# Altium schematic sheet 创世一号_键轴.SchDoc
size 699 x 350 mm
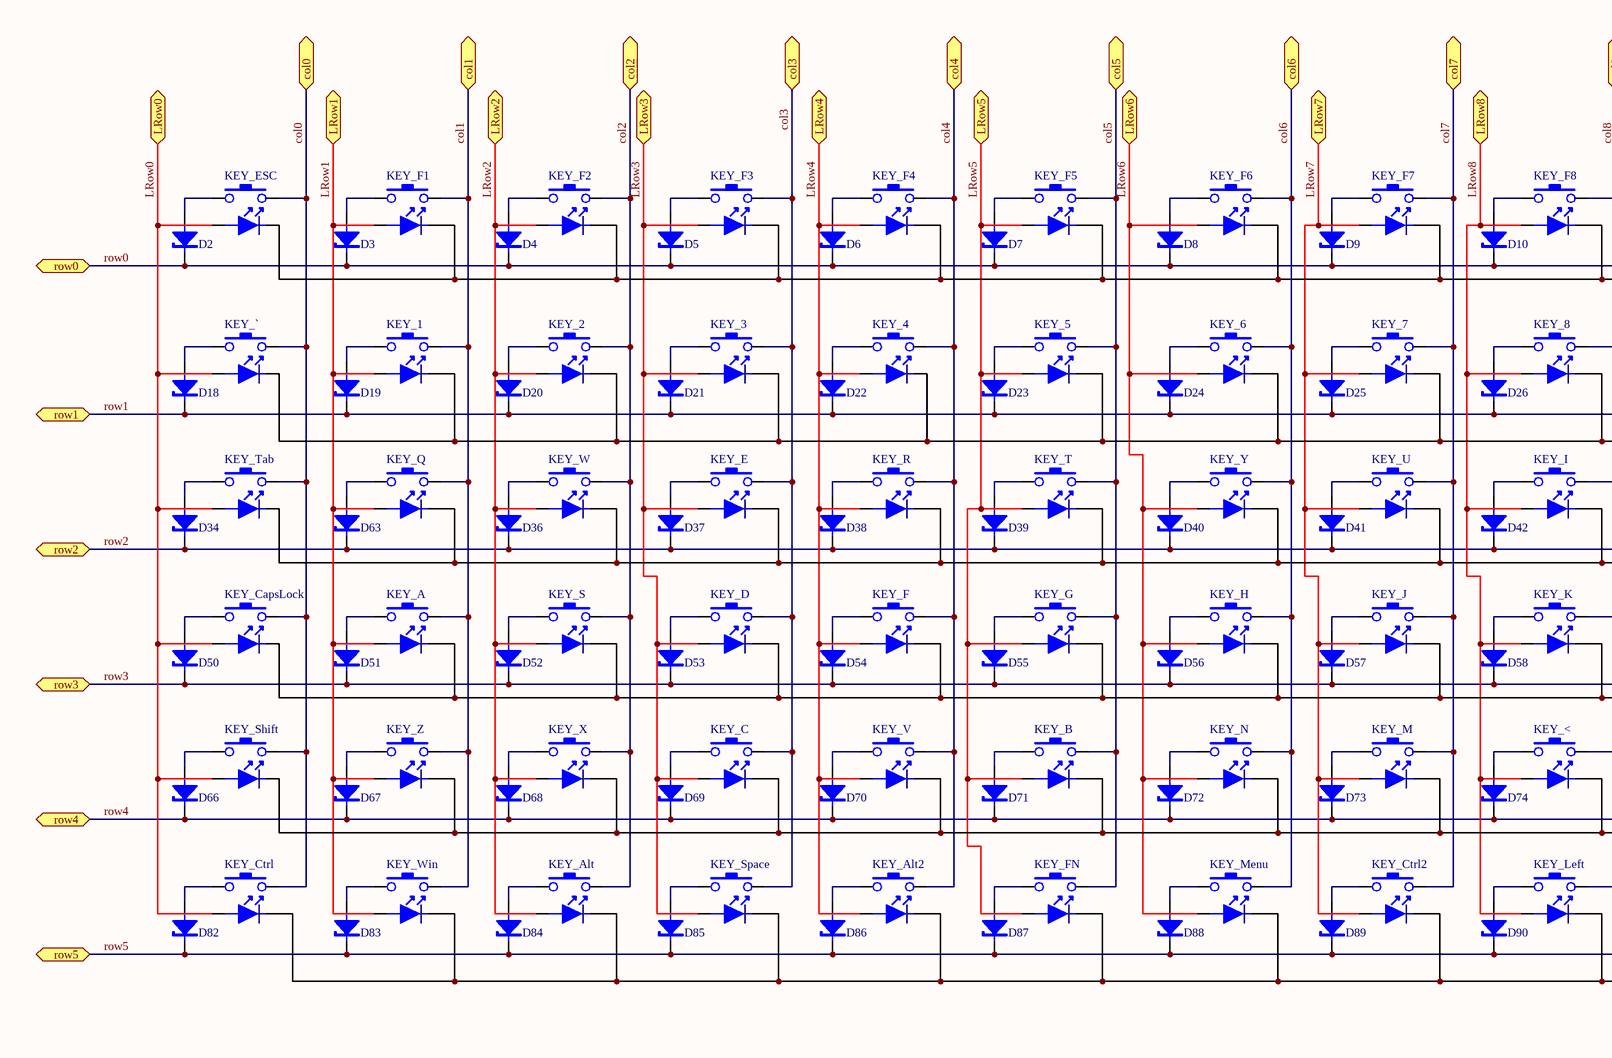
[diagram p0: 创世一号_键轴.SchDoc, left]
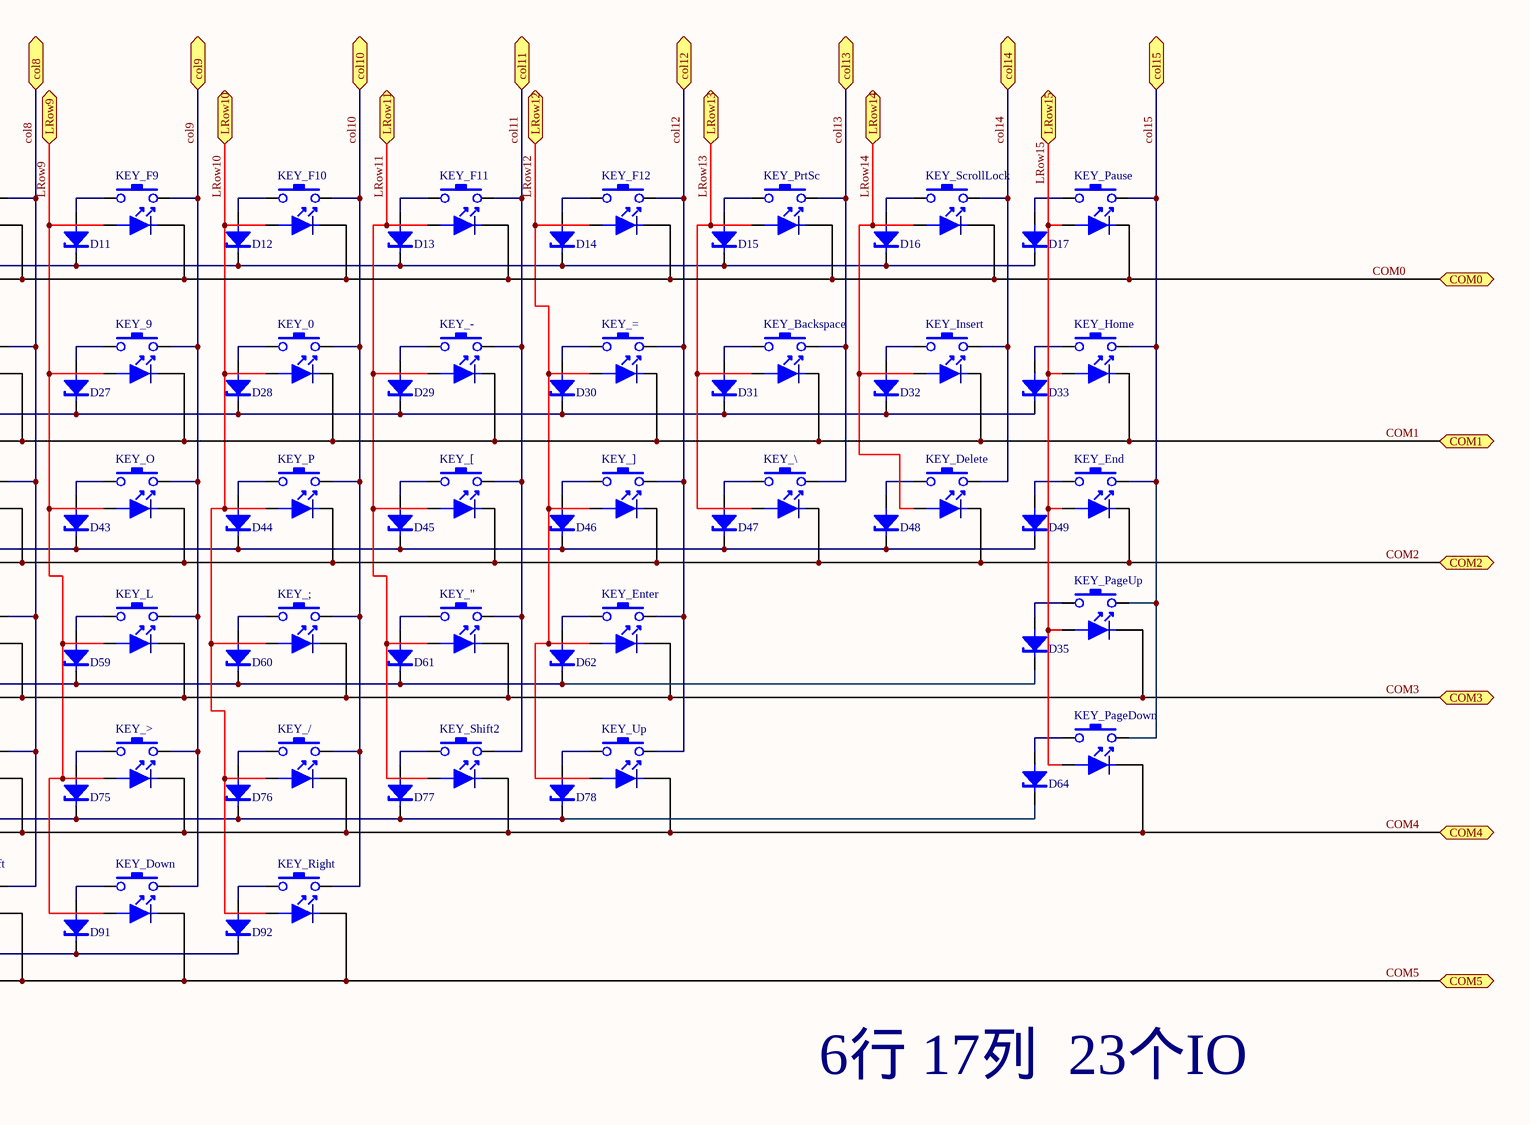
[diagram p1: 创世一号_键轴.SchDoc, right]

## Parts
D2  Diode  [SDO-123]  (value not drawn)
D3  Diode  [SDO-123]  (value not drawn)
D4  Diode  [SDO-123]  (value not drawn)
D5  Diode  [SDO-123]  (value not drawn)
D6  Diode  [SDO-123]  (value not drawn)
D7  Diode  [SDO-123]  (value not drawn)
D8  Diode  [SDO-123]  (value not drawn)
D9  Diode  [SDO-123]  (value not drawn)
D10  Diode  [SDO-123]  (value not drawn)
D11  Diode  [SDO-123]  (value not drawn)
D12  Diode  [SDO-123]  (value not drawn)
D13  Diode  [SDO-123]  (value not drawn)
D14  Diode  [SDO-123]  (value not drawn)
D15  Diode  [SDO-123]  (value not drawn)
D16  Diode  [SDO-123]  (value not drawn)
D17  Diode  [SDO-123]  (value not drawn)
D18  Diode  [SDO-123]  (value not drawn)
D19  Diode  [SDO-123]  (value not drawn)
D20  Diode  [SDO-123]  (value not drawn)
D21  Diode  [SDO-123]  (value not drawn)
D22  Diode  [SDO-123]  (value not drawn)
D23  Diode  [SDO-123]  (value not drawn)
D24  Diode  [SDO-123]  (value not drawn)
D25  Diode  [SDO-123]  (value not drawn)
D26  Diode  [SDO-123]  (value not drawn)
D27  Diode  [SDO-123]  (value not drawn)
D28  Diode  [SDO-123]  (value not drawn)
D29  Diode  [SDO-123]  (value not drawn)
D30  Diode  [SDO-123]  (value not drawn)
D31  Diode  [SDO-123]  (value not drawn)
D32  Diode  [SDO-123]  (value not drawn)
D33  Diode  [SDO-123]  (value not drawn)
D34  Diode  [SDO-123]  (value not drawn)
D35  Diode  [SDO-123]  (value not drawn)
D36  Diode  [SDO-123]  (value not drawn)
D37  Diode  [SDO-123]  (value not drawn)
D38  Diode  [SDO-123]  (value not drawn)
D39  Diode  [SDO-123]  (value not drawn)
D40  Diode  [SDO-123]  (value not drawn)
D41  Diode  [SDO-123]  (value not drawn)
D42  Diode  [SDO-123]  (value not drawn)
D43  Diode  [SDO-123]  (value not drawn)
D44  Diode  [SDO-123]  (value not drawn)
D45  Diode  [SDO-123]  (value not drawn)
D46  Diode  [SDO-123]  (value not drawn)
D47  Diode  [SDO-123]  (value not drawn)
D48  Diode  [SDO-123]  (value not drawn)
D49  Diode  [SDO-123]  (value not drawn)
D50  Diode  [SDO-123]  (value not drawn)
D51  Diode  [SDO-123]  (value not drawn)
D52  Diode  [SDO-123]  (value not drawn)
D53  Diode  [SDO-123]  (value not drawn)
D54  Diode  [SDO-123]  (value not drawn)
D55  Diode  [SDO-123]  (value not drawn)
D56  Diode  [SDO-123]  (value not drawn)
D57  Diode  [SDO-123]  (value not drawn)
D58  Diode  [SDO-123]  (value not drawn)
D59  Diode  [SDO-123]  (value not drawn)
D60  Diode  [SDO-123]  (value not drawn)
D61  Diode  [SDO-123]  (value not drawn)
D62  Diode  [SDO-123]  (value not drawn)
D63  Diode  [SDO-123]  (value not drawn)
D64  Diode  [SDO-123]  (value not drawn)
D66  Diode  [SDO-123]  (value not drawn)
D67  Diode  [SDO-123]  (value not drawn)
D68  Diode  [SDO-123]  (value not drawn)
D69  Diode  [SDO-123]  (value not drawn)
D70  Diode  [SDO-123]  (value not drawn)
D71  Diode  [SDO-123]  (value not drawn)
D72  Diode  [SDO-123]  (value not drawn)
D73  Diode  [SDO-123]  (value not drawn)
D74  Diode  [SDO-123]  (value not drawn)
D75  Diode  [SDO-123]  (value not drawn)
D76  Diode  [SDO-123]  (value not drawn)
D77  Diode  [SDO-123]  (value not drawn)
D78  Diode  [SDO-123]  (value not drawn)
D82  Diode  [SDO-123]  (value not drawn)
D83  Diode  [SDO-123]  (value not drawn)
D84  Diode  [SDO-123]  (value not drawn)
D85  Diode  [SDO-123]  (value not drawn)
D86  Diode  [SDO-123]  (value not drawn)
D87  Diode  [SDO-123]  (value not drawn)
D88  Diode  [SDO-123]  (value not drawn)
D89  Diode  [SDO-123]  (value not drawn)
D90  Diode  [SDO-123]  (value not drawn)
D91  Diode  [SDO-123]  (value not drawn)
D92  Diode  [SDO-123]  (value not drawn)
KEY_0  MX_SW  [MX_SW-5]  (value not drawn)
KEY_1  MX_SW  [MX_SW-5]  (value not drawn)
KEY_2  MX_SW  [MX_SW-5]  (value not drawn)
KEY_3  MX_SW  [MX_SW-5]  (value not drawn)
KEY_4  MX_SW  [MX_SW-5]  (value not drawn)
KEY_5  MX_SW  [MX_SW-5]  (value not drawn)
KEY_6  MX_SW  [MX_SW-5]  (value not drawn)
KEY_7  MX_SW  [MX_SW-5]  (value not drawn)
KEY_8  MX_SW  [MX_SW-5]  (value not drawn)
KEY_9  MX_SW  [MX_SW-5]  (value not drawn)
KEY_"  MX_SW  [MX_SW-5]  (value not drawn)
KEY_-  MX_SW  [MX_SW-5]  (value not drawn)
KEY_/  MX_SW  [MX_SW-5]  (value not drawn)
KEY_;  MX_SW  [MX_SW-5]  (value not drawn)
KEY_<  MX_SW  [MX_SW-5]  (value not drawn)
KEY_=  MX_SW  [MX_SW-5]  (value not drawn)
KEY_>  MX_SW  [MX_SW-5]  (value not drawn)
KEY_[  MX_SW  [MX_SW-5]  (value not drawn)
KEY_\  MX_SW  [MX_SW-5]  (value not drawn)
KEY_]  MX_SW  [MX_SW-5]  (value not drawn)
KEY_`  MX_SW  [MX_SW-5]  (value not drawn)
KEY_A  MX_SW  [MX_SW-5]  (value not drawn)
KEY_Alt  MX_SW  [MX_SW-5]  (value not drawn)
KEY_Alt2  MX_SW  [MX_SW-5]  (value not drawn)
KEY_B  MX_SW  [MX_SW-5]  (value not drawn)
KEY_Backspace  MX_SW  [MX_SW-5]  (value not drawn)
KEY_C  MX_SW  [MX_SW-5]  (value not drawn)
KEY_CapsLock  MX_SW  [MX_SW-5]  (value not drawn)
KEY_Ctrl  MX_SW  [MX_SW-5]  (value not drawn)
KEY_Ctrl2  MX_SW  [MX_SW-5]  (value not drawn)
KEY_D  MX_SW  [MX_SW-5]  (value not drawn)
KEY_Delete  MX_SW  [MX_SW-5]  (value not drawn)
KEY_Down  MX_SW  [MX_SW-5]  (value not drawn)
KEY_E  MX_SW  [MX_SW-5]  (value not drawn)
KEY_End  MX_SW  [MX_SW-5]  (value not drawn)
KEY_Enter  MX_SW  [MX_SW-5]  (value not drawn)
KEY_ESC  MX_SW  [MX_SW-5]  (value not drawn)
KEY_F  MX_SW  [MX_SW-5]  (value not drawn)
KEY_F1  MX_SW  [MX_SW-5]  (value not drawn)
KEY_F2  MX_SW  [MX_SW-5]  (value not drawn)
KEY_F3  MX_SW  [MX_SW-5]  (value not drawn)
KEY_F4  MX_SW  [MX_SW-5]  (value not drawn)
KEY_F5  MX_SW  [MX_SW-5]  (value not drawn)
KEY_F6  MX_SW  [MX_SW-5]  (value not drawn)
KEY_F7  MX_SW  [MX_SW-5]  (value not drawn)
KEY_F8  MX_SW  [MX_SW-5]  (value not drawn)
KEY_F9  MX_SW  [MX_SW-5]  (value not drawn)
KEY_F10  MX_SW  [MX_SW-5]  (value not drawn)
KEY_F11  MX_SW  [MX_SW-5]  (value not drawn)
KEY_F12  MX_SW  [MX_SW-5]  (value not drawn)
KEY_FN  MX_SW  [MX_SW-5]  (value not drawn)
KEY_G  MX_SW  [MX_SW-5]  (value not drawn)
KEY_H  MX_SW  [MX_SW-5]  (value not drawn)
KEY_Home  MX_SW  [MX_SW-5]  (value not drawn)
KEY_I  MX_SW  [MX_SW-5]  (value not drawn)
KEY_Insert  MX_SW  [MX_SW-5]  (value not drawn)
KEY_J  MX_SW  [MX_SW-5]  (value not drawn)
KEY_K  MX_SW  [MX_SW-5]  (value not drawn)
KEY_L  MX_SW  [MX_SW-5]  (value not drawn)
KEY_Left  MX_SW  [MX_SW-5]  (value not drawn)
KEY_M  MX_SW  [MX_SW-5]  (value not drawn)
KEY_Menu  MX_SW  [MX_SW-5]  (value not drawn)
KEY_N  MX_SW  [MX_SW-5]  (value not drawn)
KEY_O  MX_SW  [MX_SW-5]  (value not drawn)
KEY_P  MX_SW  [MX_SW-5]  (value not drawn)
KEY_PageDown  MX_SW  [MX_SW-5]  (value not drawn)
KEY_PageUp  MX_SW  [MX_SW-5]  (value not drawn)
KEY_Pause  MX_SW  [MX_SW-5]  (value not drawn)
KEY_PrtSc  MX_SW  [MX_SW-5]  (value not drawn)
KEY_Q  MX_SW  [MX_SW-5]  (value not drawn)
KEY_R  MX_SW  [MX_SW-5]  (value not drawn)
KEY_Right  MX_SW  [MX_SW-5]  (value not drawn)
KEY_S  MX_SW  [MX_SW-5]  (value not drawn)
KEY_ScrollLock  MX_SW  [MX_SW-5]  (value not drawn)
KEY_Shift  MX_SW  [MX_SW-5]  (value not drawn)
KEY_Shift2  MX_SW  [MX_SW-5]  (value not drawn)
KEY_Space  MX_SW  [MX_SW-5]  (value not drawn)
KEY_T  MX_SW  [MX_SW-5]  (value not drawn)
KEY_Tab  MX_SW  [MX_SW-5]  (value not drawn)
KEY_U  MX_SW  [MX_SW-5]  (value not drawn)
KEY_Up  MX_SW  [MX_SW-5]  (value not drawn)
KEY_V  MX_SW  [MX_SW-5]  (value not drawn)
KEY_W  MX_SW  [MX_SW-5]  (value not drawn)
KEY_Win  MX_SW  [MX_SW-5]  (value not drawn)
KEY_X  MX_SW  [MX_SW-5]  (value not drawn)
KEY_Y  MX_SW  [MX_SW-5]  (value not drawn)
KEY_Z  MX_SW  [MX_SW-5]  (value not drawn)

## Ports
col0 (bidir), col1 (bidir), col2 (bidir), col3 (bidir), col4 (bidir), col5 (bidir), col6 (bidir), col7 (bidir), col8 (bidir), col9 (bidir), col10 (bidir), col11 (bidir), col12 (bidir), col13 (bidir), col14 (bidir), col15 (bidir), COM0 (bidir), COM1 (bidir), COM2 (bidir), COM3 (bidir), COM4 (bidir), COM5 (bidir), LRow0 (bidir), LRow1 (bidir), LRow2 (bidir), LRow3 (bidir), LRow4 (bidir), LRow5 (bidir), LRow6 (bidir), LRow7 (bidir), LRow8 (bidir), LRow9 (bidir), LRow10 (bidir), LRow11 (bidir), LRow12 (bidir), LRow13 (bidir), LRow14 (bidir), LRow15 (bidir), row0 (bidir), row1 (bidir), row2 (bidir), row3 (bidir), row4 (bidir), row5 (bidir)

## Nets
col0: KEY_`.2 KEY_CapsLock.2 KEY_Ctrl.2 KEY_ESC.2 KEY_Shift.2 KEY_Tab.2 ; port col0
col1: KEY_1.2 KEY_A.2 KEY_F1.2 KEY_Q.2 KEY_Win.2 KEY_Z.2 ; port col1
col2: KEY_2.2 KEY_Alt.2 KEY_F2.2 KEY_S.2 KEY_W.2 KEY_X.2 ; port col2
col3: KEY_3.2 KEY_C.2 KEY_D.2 KEY_E.2 KEY_F3.2 KEY_Space.2 ; port col3
col4: KEY_4.2 KEY_Alt2.2 KEY_F.2 KEY_F4.2 KEY_R.2 KEY_V.2 ; port col4
col5: KEY_5.2 KEY_B.2 KEY_F5.2 KEY_FN.2 KEY_G.2 KEY_T.2 ; port col5
col6: KEY_6.2 KEY_F6.2 KEY_H.2 KEY_Menu.2 KEY_N.2 KEY_Y.2 ; port col6
col7: KEY_7.2 KEY_Ctrl2.2 KEY_F7.2 KEY_J.2 KEY_M.2 KEY_U.2 ; port col7
col8: KEY_8.2 KEY_<.2 KEY_F8.2 KEY_I.2 KEY_K.2 KEY_Left.2 ; port col8
col9: KEY_9.2 KEY_>.2 KEY_Down.2 KEY_F9.2 KEY_L.2 KEY_O.2 ; port col9
col10: KEY_0.2 KEY_/.2 KEY_;.2 KEY_F10.2 KEY_P.2 KEY_Right.2 ; port col10
col11: KEY_".2 KEY_-.2 KEY_[.2 KEY_F11.2 KEY_Shift2.2 ; port col11
col12: KEY_=.2 KEY_].2 KEY_Enter.2 KEY_F12.2 KEY_Up.2 ; port col12
col13: KEY_\.2 KEY_Backspace.2 KEY_PrtSc.2 ; port col13
col14: KEY_Delete.2 KEY_Insert.2 KEY_ScrollLock.2 ; port col14
col15: KEY_End.2 KEY_Home.2 KEY_PageDown.2 KEY_PageUp.2 KEY_Pause.2 ; port col15
COM0: KEY_ESC.4 KEY_F1.4 KEY_F2.4 KEY_F3.4 KEY_F4.4 KEY_F5.4 KEY_F6.4 KEY_F7.4 KEY_F8.4 KEY_F9.4 KEY_F10.4 KEY_F11.4 KEY_F12.4 KEY_Pause.4 KEY_PrtSc.4 KEY_ScrollLock.4 ; port COM0
COM1: KEY_0.4 KEY_1.4 KEY_2.4 KEY_3.4 KEY_4.4 KEY_5.4 KEY_6.4 KEY_7.4 KEY_8.4 KEY_9.4 KEY_-.4 KEY_=.4 KEY_`.4 KEY_Backspace.4 KEY_Home.4 KEY_Insert.4 ; port COM1
COM2: KEY_[.4 KEY_\.4 KEY_].4 KEY_Delete.4 KEY_E.4 KEY_End.4 KEY_I.4 KEY_O.4 KEY_P.4 KEY_Q.4 KEY_R.4 KEY_T.4 KEY_Tab.4 KEY_U.4 KEY_W.4 KEY_Y.4 ; port COM2
COM3: KEY_".4 KEY_;.4 KEY_A.4 KEY_CapsLock.4 KEY_D.4 KEY_Enter.4 KEY_F.4 KEY_G.4 KEY_H.4 KEY_J.4 KEY_K.4 KEY_L.4 KEY_PageUp.4 KEY_S.4 ; port COM3
COM4: KEY_/.4 KEY_<.4 KEY_>.4 KEY_B.4 KEY_C.4 KEY_M.4 KEY_N.4 KEY_PageDown.4 KEY_Shift.4 KEY_Shift2.4 KEY_Up.4 KEY_V.4 KEY_X.4 KEY_Z.4 ; port COM4
COM5: KEY_Alt.4 KEY_Alt2.4 KEY_Ctrl.4 KEY_Ctrl2.4 KEY_Down.4 KEY_FN.4 KEY_Left.4 KEY_Menu.4 KEY_Right.4 KEY_Space.4 KEY_Win.4 ; port COM5
LRow0: KEY_`.3 KEY_CapsLock.3 KEY_Ctrl.3 KEY_ESC.3 KEY_Shift.3 KEY_Tab.3 ; port LRow0
LRow1: KEY_1.3 KEY_A.3 KEY_F1.3 KEY_Q.3 KEY_Win.3 KEY_Z.3 ; port LRow1
LRow2: KEY_2.3 KEY_Alt.3 KEY_F2.3 KEY_S.3 KEY_W.3 KEY_X.3 ; port LRow2
LRow3: KEY_3.3 KEY_C.3 KEY_D.3 KEY_E.3 KEY_F3.3 KEY_Space.3 ; port LRow3
LRow4: KEY_4.3 KEY_Alt2.3 KEY_F.3 KEY_F4.3 KEY_R.3 KEY_V.3 ; port LRow4
LRow5: KEY_5.3 KEY_B.3 KEY_F5.3 KEY_FN.3 KEY_G.3 KEY_T.3 ; port LRow5
LRow6: KEY_6.3 KEY_F6.3 KEY_H.3 KEY_Menu.3 KEY_N.3 KEY_Y.3 ; port LRow6
LRow7: KEY_7.3 KEY_Ctrl2.3 KEY_F7.3 KEY_J.3 KEY_M.3 KEY_U.3 ; port LRow7
LRow8: KEY_8.3 KEY_<.3 KEY_F8.3 KEY_I.3 KEY_K.3 KEY_Left.3 ; port LRow8
LRow9: KEY_9.3 KEY_>.3 KEY_Down.3 KEY_F9.3 KEY_L.3 KEY_O.3 ; port LRow9
LRow10: KEY_0.3 KEY_/.3 KEY_;.3 KEY_F10.3 KEY_P.3 KEY_Right.3 ; port LRow10
LRow11: KEY_".3 KEY_-.3 KEY_[.3 KEY_F11.3 KEY_Shift2.3 ; port LRow11
LRow12: KEY_=.3 KEY_].3 KEY_Enter.3 KEY_F12.3 KEY_Up.3 ; port LRow12
LRow13: KEY_\.3 KEY_Backspace.3 KEY_PrtSc.3 ; port LRow13
LRow14: KEY_Delete.3 KEY_Insert.3 KEY_ScrollLock.3 ; port LRow14
LRow15: KEY_End.3 KEY_Home.3 KEY_PageDown.3 KEY_PageUp.3 KEY_Pause.3 ; port LRow15
row0: D2.2(C) D3.2(C) D4.2(C) D5.2(C) D6.2(C) D7.2(C) D8.2(C) D9.2(C) D10.2(C) D11.2(C) D12.2(C) D13.2(C) D14.2(C) D15.2(C) D16.2(C) D17.2(C) ; port row0
row1: D18.2(C) D19.2(C) D20.2(C) D21.2(C) D22.2(C) D23.2(C) D24.2(C) D25.2(C) D26.2(C) D27.2(C) D28.2(C) D29.2(C) D30.2(C) D31.2(C) D32.2(C) D33.2(C) ; port row1
row2: D34.2(C) D36.2(C) D37.2(C) D38.2(C) D39.2(C) D40.2(C) D41.2(C) D42.2(C) D43.2(C) D44.2(C) D45.2(C) D46.2(C) D47.2(C) D48.2(C) D49.2(C) D63.2(C) ; port row2
row3: D35.2(C) D50.2(C) D51.2(C) D52.2(C) D53.2(C) D54.2(C) D55.2(C) D56.2(C) D57.2(C) D58.2(C) D59.2(C) D60.2(C) D61.2(C) D62.2(C) ; port row3
row4: D64.2(C) D66.2(C) D67.2(C) D68.2(C) D69.2(C) D70.2(C) D71.2(C) D72.2(C) D73.2(C) D74.2(C) D75.2(C) D76.2(C) D77.2(C) D78.2(C) ; port row4
row5: D82.2(C) D83.2(C) D84.2(C) D85.2(C) D86.2(C) D87.2(C) D88.2(C) D89.2(C) D90.2(C) D91.2(C) D92.2(C) ; port row5
NetD2_1: D2.1(A) KEY_ESC.1
NetD3_1: D3.1(A) KEY_F1.1
NetD4_1: D4.1(A) KEY_F2.1
NetD5_1: D5.1(A) KEY_F3.1
NetD6_1: D6.1(A) KEY_F4.1
NetD7_1: D7.1(A) KEY_F5.1
NetD8_1: D8.1(A) KEY_F6.1
NetD9_1: D9.1(A) KEY_F7.1
NetD10_1: D10.1(A) KEY_F8.1
NetD11_1: D11.1(A) KEY_F9.1
NetD12_1: D12.1(A) KEY_F10.1
NetD13_1: D13.1(A) KEY_F11.1
NetD14_1: D14.1(A) KEY_F12.1
NetD15_1: D15.1(A) KEY_PrtSc.1
NetD16_1: D16.1(A) KEY_ScrollLock.1
NetD17_1: D17.1(A) KEY_Pause.1
NetD18_1: D18.1(A) KEY_`.1
NetD19_1: D19.1(A) KEY_1.1
NetD20_1: D20.1(A) KEY_2.1
NetD21_1: D21.1(A) KEY_3.1
NetD22_1: D22.1(A) KEY_4.1
NetD23_1: D23.1(A) KEY_5.1
NetD24_1: D24.1(A) KEY_6.1
NetD25_1: D25.1(A) KEY_7.1
NetD26_1: D26.1(A) KEY_8.1
NetD27_1: D27.1(A) KEY_9.1
NetD28_1: D28.1(A) KEY_0.1
NetD29_1: D29.1(A) KEY_-.1
NetD30_1: D30.1(A) KEY_=.1
NetD31_1: D31.1(A) KEY_Backspace.1
NetD32_1: D32.1(A) KEY_Insert.1
NetD33_1: D33.1(A) KEY_Home.1
NetD34_1: D34.1(A) KEY_Tab.1
NetD35_1: D35.1(A) KEY_PageUp.1
NetD36_1: D36.1(A) KEY_W.1
NetD37_1: D37.1(A) KEY_E.1
NetD38_1: D38.1(A) KEY_R.1
NetD39_1: D39.1(A) KEY_T.1
NetD40_1: D40.1(A) KEY_Y.1
NetD41_1: D41.1(A) KEY_U.1
NetD42_1: D42.1(A) KEY_I.1
NetD43_1: D43.1(A) KEY_O.1
NetD44_1: D44.1(A) KEY_P.1
NetD45_1: D45.1(A) KEY_[.1
NetD46_1: D46.1(A) KEY_].1
NetD47_1: D47.1(A) KEY_\.1
NetD48_1: D48.1(A) KEY_Delete.1
NetD49_1: D49.1(A) KEY_End.1
NetD50_1: D50.1(A) KEY_CapsLock.1
NetD51_1: D51.1(A) KEY_A.1
NetD52_1: D52.1(A) KEY_S.1
NetD53_1: D53.1(A) KEY_D.1
NetD54_1: D54.1(A) KEY_F.1
NetD55_1: D55.1(A) KEY_G.1
NetD56_1: D56.1(A) KEY_H.1
NetD57_1: D57.1(A) KEY_J.1
NetD58_1: D58.1(A) KEY_K.1
NetD59_1: D59.1(A) KEY_L.1
NetD60_1: D60.1(A) KEY_;.1
NetD61_1: D61.1(A) KEY_".1
NetD62_1: D62.1(A) KEY_Enter.1
NetD63_1: D63.1(A) KEY_Q.1
NetD64_1: D64.1(A) KEY_PageDown.1
NetD66_1: D66.1(A) KEY_Shift.1
NetD67_1: D67.1(A) KEY_Z.1
NetD68_1: D68.1(A) KEY_X.1
NetD69_1: D69.1(A) KEY_C.1
NetD70_1: D70.1(A) KEY_V.1
NetD71_1: D71.1(A) KEY_B.1
NetD72_1: D72.1(A) KEY_N.1
NetD73_1: D73.1(A) KEY_M.1
NetD74_1: D74.1(A) KEY_<.1
NetD75_1: D75.1(A) KEY_>.1
NetD76_1: D76.1(A) KEY_/.1
NetD77_1: D77.1(A) KEY_Shift2.1
NetD78_1: D78.1(A) KEY_Up.1
NetD82_1: D82.1(A) KEY_Ctrl.1
NetD83_1: D83.1(A) KEY_Win.1
NetD84_1: D84.1(A) KEY_Alt.1
NetD85_1: D85.1(A) KEY_Space.1
NetD86_1: D86.1(A) KEY_Alt2.1
NetD87_1: D87.1(A) KEY_FN.1
NetD88_1: D88.1(A) KEY_Menu.1
NetD89_1: D89.1(A) KEY_Ctrl2.1
NetD90_1: D90.1(A) KEY_Left.1
NetD91_1: D91.1(A) KEY_Down.1
NetD92_1: D92.1(A) KEY_Right.1

## Notes on the sheet
- 6行 17列  23个IO

## Library data of the parts
KEY_0-KEY_9 KEY_" KEY_- KEY_/ KEY_; KEY_< KEY_= KEY_> KEY_[ KEY_\ KEY_] KEY_` KEY_A KEY_Alt KEY_Alt2 KEY_B KEY_Backspace KEY_C KEY_CapsLock KEY_Ctrl KEY_Ctrl2 KEY_D KEY_Delete KEY_Down KEY_E KEY_End KEY_Enter KEY_ESC KEY_F KEY_F1-KEY_F12 KEY_FN KEY_G KEY_H KEY_Home KEY_I KEY_Insert KEY_J KEY_K KEY_L KEY_Left KEY_M KEY_Menu KEY_N KEY_O KEY_P KEY_PageDown KEY_PageUp KEY_Pause KEY_PrtSc KEY_Q KEY_R KEY_Right KEY_S KEY_ScrollLock KEY_Shift KEY_Shift2 KEY_Space KEY_T KEY_Tab KEY_U KEY_Up KEY_V KEY_W KEY_Win KEY_X KEY_Y KEY_Z = MX_SW-5: with Fixation pins  1-Pole w/LED